# Altium schematic sheet Pg3-Voltage signal condtioning.SchDoc: Analog Front End Opamp (Voltage)
size 431 x 279 mm; Date: Not shown in title block; ApprovedBy: Not shown in title block; CheckedBy: Not shown in title block; Author: Not shown in title block; CompanyName: Not shown in title block; Engineer: Not shown in title block; Organization: Not shown in title block; Address1: Not shown in title block; Address2: Not shown in title block; Address3: Not shown in title block; Address4: Not shown in title block; DocumentNumber: 4; Revision: Use project parameter SCH_Rev; SheetNumber: 3; SheetTotal: 7; PageSetup: Record=PageOptions|CenterHorizontal=True|CenterVertical=True|PrintScale=1.00|XCorrection=1.00|YCorrection=1.00|PrintKind=0|BorderSize=5000000|LeftOffset=0|BottomOffset=0|Orientation=2|PaperLength=1000|PaperWidth=1000|Scale=100|PaperSource=15|PrintQuality=600|MediaType=1|DitherType=10|PaperKind=Letter|PrintScaleMode=1; CurrentTime: Not shown in title block; CurrentDate: Not shown in title block; Time: Not shown in title block; DocumentFullPathAndName: Not shown in title block; DocumentName: Not shown in title block; ModifiedDate: Not shown in title block; ImagePath: Not shown in title block
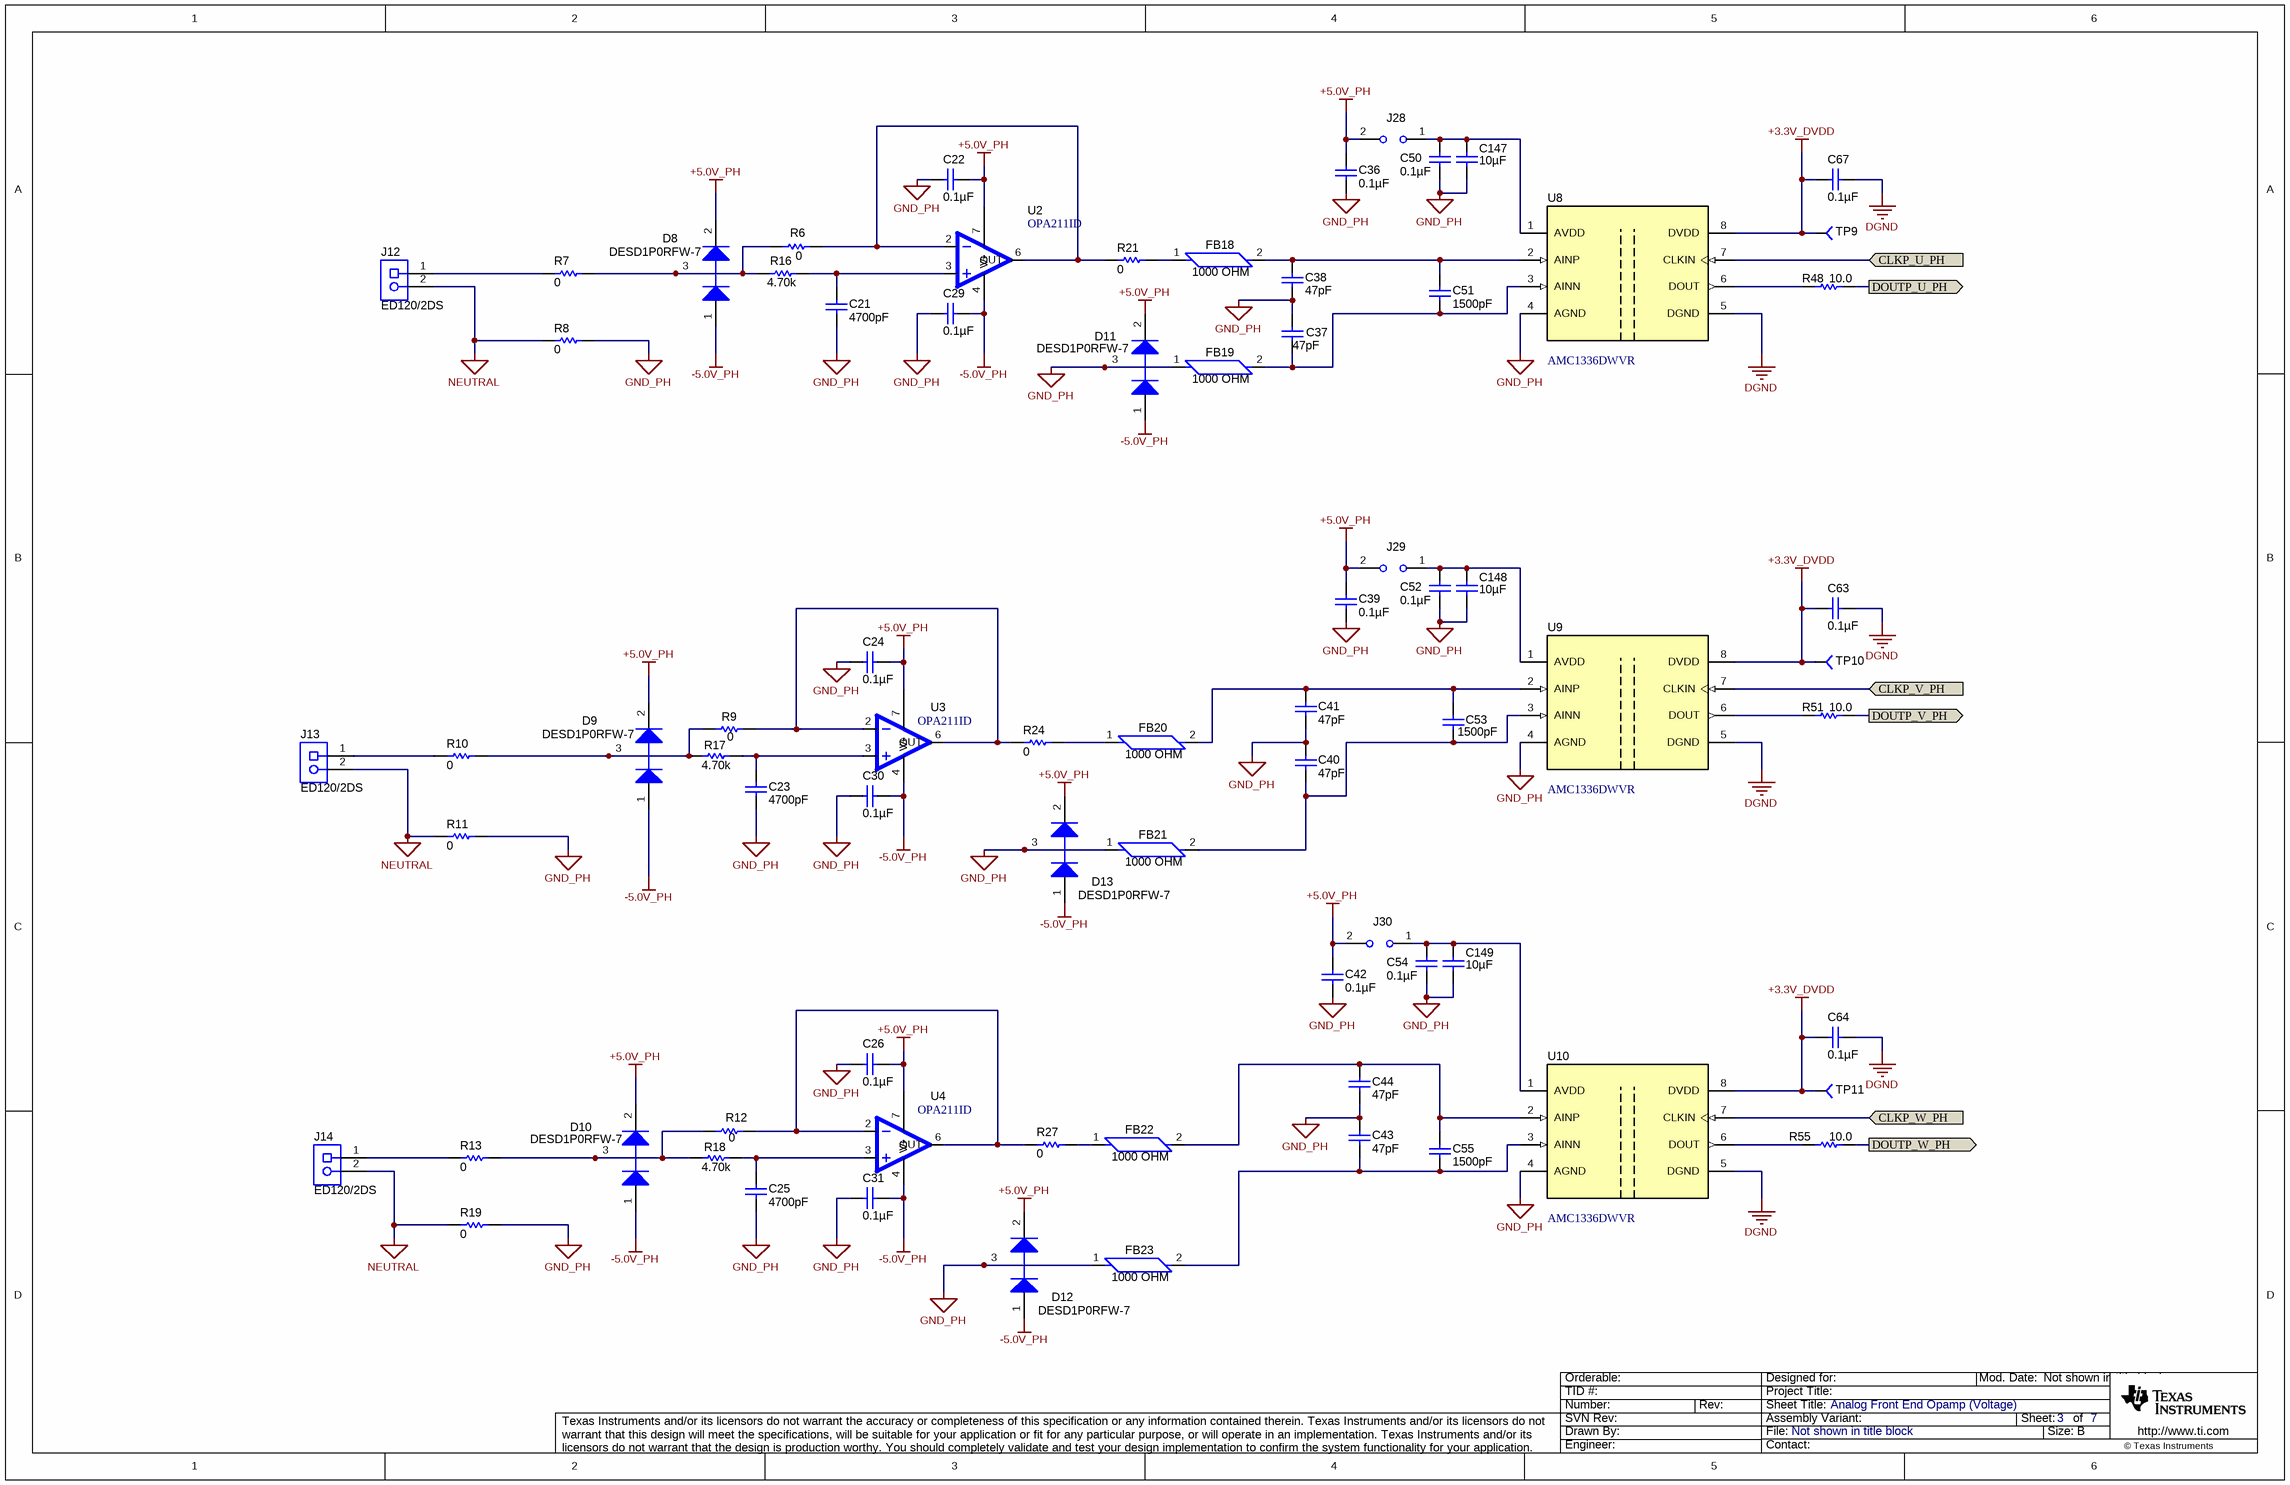
[diagram p0: Pg3-Voltage signal condtioning.SchDoc]

## Parts
C21  ValueDisplayed: 4700pF  [0603]
C22  ValueDisplayed: 0.1µF  [0603]
C23  ValueDisplayed: 4700pF  [0603]
C24  ValueDisplayed: 0.1µF  [0603]
C25  ValueDisplayed: 4700pF  [0603]
C26  ValueDisplayed: 0.1µF  [0603]
C29  ValueDisplayed: 0.1µF  [0603]
C30  ValueDisplayed: 0.1µF  [0603]
C31  ValueDisplayed: 0.1µF  [0603]
C36  ValueDisplayed: 0.1µF  [0603]
C37  ValueDisplayed: 47pF  [0805_HV]  (hidden comment: GRM21A5C2E470JW01D)
C38  ValueDisplayed: 47pF  [0805_HV]  (hidden comment: GRM21A5C2E470JW01D)
C39  ValueDisplayed: 0.1µF  [0603]
C40  ValueDisplayed: 47pF  [0805_HV]  (hidden comment: GRM21A5C2E470JW01D)
C41  ValueDisplayed: 47pF  [0805_HV]  (hidden comment: GRM21A5C2E470JW01D)
C42  ValueDisplayed: 0.1µF  [0603]
C43  ValueDisplayed: 47pF  [0805_HV]  (hidden comment: GRM21A5C2E470JW01D)
C44  ValueDisplayed: 47pF  [0805_HV]  (hidden comment: GRM21A5C2E470JW01D)
C50  ValueDisplayed: 0.1µF  [0603]
C51  ValueDisplayed: 1500pF  [0603]  (hidden comment: 06031C152KAT2A)
C52  ValueDisplayed: 0.1µF  [0603]
C53  ValueDisplayed: 1500pF  [0603]  (hidden comment: 06031C152KAT2A)
C54  ValueDisplayed: 0.1µF  [0603]
C55  ValueDisplayed: 1500pF  [0603]  (hidden comment: 06031C152KAT2A)
C63  ValueDisplayed: 0.1µF  [0603]
C64  ValueDisplayed: 0.1µF  [0603]
C67  ValueDisplayed: 0.1µF  [0603]
C147  ValueDisplayed: 10µF  [1210]
C148  ValueDisplayed: 10µF  [1210]
C149  ValueDisplayed: 10µF  [1210]
D8  DESD1P0RFW-7  [SOT-323]
D9  DESD1P0RFW-7  [SOT-323]
D10  DESD1P0RFW-7  [SOT-323]
D11  value DESD1P0RFW-7  [SOT-323]
D12  value DESD1P0RFW-7  [SOT-323]
D13  value DESD1P0RFW-7  [SOT-323]
FB18  value 1000 OHM  [FB0603]  (hidden comment: MMZ1608B102C)
FB19  value 1000 OHM  [FB0603]  (hidden comment: MMZ1608B102C)
FB20  value 1000 OHM  [FB0603]  (hidden comment: MMZ1608B102C)
FB21  value 1000 OHM  [FB0603]  (hidden comment: MMZ1608B102C)
FB22  value 1000 OHM  [FB0603]  (hidden comment: MMZ1608B102C)
FB23  value 1000 OHM  [FB0603]  (hidden comment: MMZ1608B102C)
J12  ED120/2DS  [CONN_ED120-2DS]
J13  ED120/2DS  [CONN_ED120-2DS]
J14  ED120/2DS  [CONN_ED120-2DS]
J28  (no value)  [HDR100_1X2]
J29  (no value)  [HDR100_1X2]
J30  (no value)  [HDR100_1X2]
R6  value 0  [0603]  (hidden comment: CRCW06030000Z0EA)
R7  value 0  [0805_HV]  (hidden comment: CRCW08050000Z0EA)
R8  value 0  [0805_HV]  (hidden comment: CRCW08050000Z0EA)
R9  value 0  [0603]  (hidden comment: CRCW06030000Z0EA)
R10  value 0  [0805_HV]  (hidden comment: CRCW08050000Z0EA)
R11  value 0  [0805_HV]  (hidden comment: CRCW08050000Z0EA)
R12  value 0  [0603]  (hidden comment: CRCW06030000Z0EA)
R13  value 0  [0805_HV]  (hidden comment: CRCW08050000Z0EA)
R16  value 4.70k  [0603]
R17  value 4.70k  [0603]
R18  value 4.70k  [0603]
R19  value 0  [0805_HV]  (hidden comment: CRCW08050000Z0EA)
R21  value 0  [0603]
R24  value 0  [0603]
R27  value 0  [0603]
R48  value 10.0  [0603]
R51  value 10.0  [0603]
R55  value 10.0  [0603]
TP9  (no value)  [TP-040_RND]
TP10  (no value)  [TP-040_RND]
TP11  (no value)  [TP-040_RND]
U2  OPA211ID  [SO8]
U3  OPA211ID  [SO8]
U4  OPA211ID  [SO8]
U8  AMC1336DWVR  [DWV0008A]
U9  AMC1336DWVR  [DWV0008A]
U10  AMC1336DWVR  [DWV0008A]

## Ports
CLKP_U_PH (in), CLKP_V_PH (in), CLKP_W_PH (in), DOUTP_U_PH (out), DOUTP_V_PH (out), DOUTP_W_PH (out)

## Nets
+3.3V_DVDD: C63.2 C64.2 C67.2 TP9.1 TP10.1 TP11.1 U8.8(DVDD) U9.8(DVDD) U10.8(DVDD)
+5.0V_PH: C22.2 C24.2 C26.2 C36.1 C39.1 C42.1 D8.2(K) D9.2(K) D10.2(K) D11.2(K) D12.2(K) D13.2(K) J28.2 J29.2 J30.2 U2.7(V+) U3.7(V+) U4.7(V+)
-5.0V_PH: C29.2 C30.2 C31.2 D8.1(A) D9.1(A) D10.1(A) D11.1(A) D12.1(A) D13.1(A) U2.4(V-) U3.4(V-) U4.4(V-)
DGND: C63.1 C64.1 C67.1 U8.5(DGND) U9.5(DGND) U10.5(DGND)
GND_PH: C21.2 C22.1 C23.2 C24.1 C25.2 C26.1 C29.1 C30.1 C31.1 C36.2 C37.1 C38.1 C39.2 C40.1 C41.1 C42.2 C43.1 C44.1 C50.2 C52.2 C54.2 C147.1 C148.1 C149.1 D11.3(C) D12.3(C) D13.3(C) FB19.1 FB21.1 FB23.1 R8.2 R11.2 R19.2 U8.4(AGND) U9.4(AGND) U10.4(AGND)
NEUTRAL: J12.2 J13.2 J14.2 R8.1 R11.1 R19.1
CLKP_U_PH: U8.7(CLKIN) ; port CLKP_U_PH
CLKP_V_PH: U9.7(CLKIN) ; port CLKP_V_PH
CLKP_W_PH: U10.7(CLKIN) ; port CLKP_W_PH
DOUTP_U_PH: R48.2 ; port DOUTP_U_PH
DOUTP_V_PH: R51.2 ; port DOUTP_V_PH
DOUTP_W_PH: R55.2 ; port DOUTP_W_PH
NetC21_1: C21.1 R16.2 U2.3
NetC23_1: C23.1 R17.2 U3.3
NetC25_1: C25.1 R18.2 U4.3
NetC37_2: C37.2 C51.2 FB19.2 U8.3(AINN)
NetC38_2: C38.2 C51.1 FB18.2 U8.2(AINP)
NetC40_2: C40.2 C53.2 FB21.2 U9.3(AINN)
NetC41_2: C41.2 C53.1 FB20.2 U9.2(AINP)
NetC43_2: C43.2 C55.2 FB23.2 U10.3(AINN)
NetC44_2: C44.2 C55.1 FB22.2 U10.2(AINP)
NetC50_1: C50.1 C147.2 J28.1 U8.1(AVDD)
NetC52_1: C52.1 C148.2 J29.1 U9.1(AVDD)
NetC54_1: C54.1 C149.2 J30.1 U10.1(AVDD)
NetD8_3: D8.3(C) R6.1 R7.2 R16.1
NetD9_3: D9.3(C) R9.1 R10.2 R17.1
NetD10_3: D10.3(C) R12.1 R13.2 R18.1
NetFB18_1: FB18.1 R21.2
NetFB20_1: FB20.1 R24.2
NetFB22_1: FB22.1 R27.2
NetJ12_1: J12.1 R7.1
NetJ13_1: J13.1 R10.1
NetJ14_1: J14.1 R13.1
NetR6_2: R6.2 R21.1 U2.2 U2.6(OUT)
NetR9_2: R9.2 R24.1 U3.2 U3.6(OUT)
NetR12_2: R12.2 R27.1 U4.2 U4.6(OUT)
NetR48_1: R48.1 U8.6(DOUT)
NetR51_1: R51.1 U9.6(DOUT)
NetR55_1: R55.1 U10.6(DOUT)

## Notes on the sheet
- Drawn By:
- SVN Rev:
- Number:
- TID #:
- Orderable:
- Rev:
- Sheet Title:
- File:
- Project Title:
- Designed for:
- Assembly Variant:
- Mod. Date:
- Sheet:
- Size:
- of
- B
- http://www.ti.com
- Texas Instruments and/or its licensors do not warrant the accuracy or completeness of this specification or any information contained therein. Texas Instruments and/or its licensors do not warrant that this design will meet the specifications, will be suitable for your application or fit for any particular purpose, or will operate in an implementation. Texas Instruments and/or its licensors do not warrant that the design is production worthy. You should completely validate and test your design implementation to confirm the system functionality for your application.
- Engineer:
- Contact:
- © Texas Instruments

## Library data of the parts
C21 C23 C25 = 06031C472KAT2A: CAP, CERM, 4700pF, 100V, +/-10%, X7R, 0603; Manufacturer: AVX; Polarized: N; CompType: Capacitor; U/M: EA; Cap_F: 0.0000000047; Tolerance_%: 10; ESR_Ohm: 0.136; Value1: 0.136 ohm; VDC_V: 100; TaMin_C: -55; TaMax_C: 125; SymbolVersion: 2008-07-09; Value: 4700pF; PartNumber: 06031C472KAT2A; PackageReference: 0603; RoHS: Y; Value2: 100V; MountType: SMT; Technology: Ceramic; TempCo: X7R; Cap_Case: 0603; Published: 2008-06-19; Publisher: Texas Instruments; LatestRevisionDate: 2013-12-06; ComponentLink1Description: Datasheet link; ComponentLink1URL: http://www.avx.com/docs/masterpubs/smccp.pdf; Supplier 1: Digi-Key; Supplier Part Number 1: 478-1203-1-ND; Supplier 2: Mouser; Supplier Part Number 2: 581-06031C472K; Supplier 3: Farnell; Supplier Part Number 3: 1833875
C22 C24 C26 C29-C31 C36 C39 C42 C50 C52 C54 = C0603C104K5RACTU: CAP, CERM, 0.1uF, 50V, +/-10%, X7R, 0603; Manufacturer: Kemet; Polarized: N; CompType: Capacitor; U/M: EA; Cap_F: 0.0000001; Tolerance_%: 10; Value1: Unknown; VDC_V: 50; TaMin_C: -55; TaMax_C: 125; SymbolVersion: 2008-07-09; Value: 0.1uF; PartNumber: C0603C104K5RACTU; PackageReference: 0603; RoHS: Y; Value2: 50V; MountType: SMT; Technology: Ceramic; TempCo: X7R; Cap_Case: 0603; Published: 2008-06-19; Publisher: Texas Instruments; LatestRevisionDate: 2013-12-06; ComponentLink1Description: Datasheet link; ComponentLink1URL: http://www.kemet.com/kemet/web/homepage/kechome.nsf/vapubfiles/F3102_Y5V.pdf/$file/F3102_Y5V.pdf; Supplier 1: Digi-Key; Supplier Part Number 1: 399-5089-1-ND; Supplier 2: Mouser; Supplier Part Number 2: 80-C0603C104K5R; Supplier 3: Farnell; Supplier Part Number 3: 1288255
C37 C38 C40 C41 C43 C44 = GRM21A5C2E470JW01D: CAP, CERM, 47pF, 500V, +/-5%, C0G/NP0, 0805; Manufacturer: MuRata; Polarized: N; CompType: Capacitor; U/M: EA; Cap_F: 0.000000000047; Tolerance_%: 5; Value1: Unknown; VDC_V: 250; Value2: 250V; TaMin_C: -55; TaMax_C: 125; Cap_Case: 0805; SymbolVersion: 2008-07-09; Value: 47pF; PartNumber: GRM21A5C2E470JW01D; PackageReference: 0805; RoHS: Y; MountType: SMT; Technology: Ceramic; TempCo: C0G/NP0; Published: 2008-06-19; Publisher: Texas Instruments; LatestRevisionDate: 2014-05-15; ComponentLink1Description: Datasheet link; ComponentLink1URL: http://search.murata.co.jp/Ceramy/PnsearchViewAction.do?HnOFG=ON&HnNFG=ON&SEL_CNT=50&sLang=en&sKey=GRM21A5C2E470JW01D&x=9&y=9&search=startwith; Supplier 1: Digi-Key; Supplier Part Number 1: 490-5538-1-ND; Supplier 2: Mouser; Supplier Part Number 2: 81-GRM21A5C2E470JW1D
C51 C53 C55 = 06031C152KAT2A: CAP, CERM, 1500pF, 100V, +/-10%, X7R, 0603; Manufacturer: AVX; Polarized: N; CompType: Capacitor; U/M: EA; Cap_F: 0.0000000015; Tolerance_%: 10; ESR_Ohm: 0.229; Value1: 0.229 ohm; VDC_V: 100; TaMin_C: -55; TaMax_C: 125; SymbolVersion: 2008-07-09; Value: 1500pF; PartNumber: 06031C152KAT2A; PackageReference: 0603; RoHS: Y; Value2: 100V; MountType: SMT; Technology: Ceramic; TempCo: X7R; Cap_Case: 0603; Published: 2008-06-19; Publisher: Texas Instruments; LatestRevisionDate: 2013-12-23; ComponentLink1Description: Datasheet link; ComponentLink1URL: http://www.avx.com/docs/masterpubs/smccp.pdf; Supplier 1: Digi-Key; Supplier Part Number 1: 478-1200-1-ND; Supplier 2: Mouser; Supplier Part Number 2: 581-06031C152K; Supplier 3: Farnell; Supplier Part Number 3: 1396445
C63 C64 C67 = 06033C104JAT2A: CAP, CERM, 0.1uF, 25V, +/-5%, X7R, 0603; Manufacturer: AVX; Polarized: N; CompType: Capacitor; U/M: EA; Cap_F: 0.0000001; Tolerance_%: 5; ESR_Ohm: 0.05; Value1: 0.05 ohm; VDC_V: 25; TaMin_C: -55; TaMax_C: 125; SymbolVersion: 2008-07-09; Value: 0.1uF; PartNumber: 06033C104JAT2A; PackageReference: 0603; RoHS: Y; Value2: 25V; MountType: SMT; Technology: Ceramic; TempCo: X7R; Cap_Case: 0603; Published: 2008-06-19; Publisher: Texas Instruments; LatestRevisionDate: 2013-12-06; ComponentLink1Description: Datasheet link; ComponentLink1URL: http://www.avx.com/docs/masterpubs/smccp.pdf; Supplier 1: Digi-Key; Supplier Part Number 1: 478-3713-1-ND; Supplier 2: Mouser; Supplier Part Number 2: 581-06033C104JAT2A; Supplier 3: Farnell; Supplier Part Number 3: 1740614
C147-C149 = GMK325AB7106MM-T: CAP, CERM, 10uF, 35V, +/-20%, X7R, 1210; Manufacturer: Taiyo Yuden; Polarized: N; CompType: Capacitor; U/M: EA; Cap_F: 0.00001; Tolerance_%: 20; Value1: Unknown; VDC_V: 35; TaMin_C: -55; TaMax_C: 125; PackageReference: 1210; PartNumber: GMK325AB7106MM-T; SymbolVersion: 2008-07-09; Value: 10uF; RoHS: Y; Value2: 35V; MountType: SMT; Technology: Ceramic; Cap_Case: 1210; Publisher: Texas Instruments; LatestRevisionDate: 2013-12-06; ComponentLink1Description: Datasheet link; ComponentLink1URL: http://www.yuden.co.jp/productdata/catalog/en/mlcc01_e.pdf; Supplier 1: Digi-Key; Supplier Part Number 1: 587-2779-1-ND; Supplier 2: Mouser; Supplier Part Number 2: 963-GMK325AB7106MM-T; Supplier 3: Farnell; Supplier Part Number 3: 1894510; TempCo: X7R; Published: 2008-06-19
D8-D10 = BAV99WT1G: Diode, P-N, 70V, 0.2A, SOT-323; Manufacturer: Diodes Inc; Value: DNP; SymbolVersion: 2011-08-17; PartNumber: DESD1P0RFW-7; PackageReference: SOT-323; CompType: Diode; MountType: SMT; Type: P-N; RoHS: Y; Published: 2008-06-26; Publisher: Texas Instruments; LatestRevisionDate: 2013-11-22; ComponentLink1Description: Datasheet link; ComponentLink1URL: http://www.diodes.com/datasheets/DESD1P0RFW.pdf; Supplier 1: Digi-Key; Supplier Part Number 1: DESD1P0RFW-7DIDKR-ND; Supplier 2: Mouser; Supplier Part Number 2: 512-BAV99WT1G
D11-D13 = BAV99WT1G: Diode, P-N, 70V, 0.2A, SOT-323; Manufacturer: Diodes Inc; SymbolVersion: 2011-08-17; PartNumber: DESD1P0RFW-7; PackageReference: SOT-323; CompType: Diode; MountType: SMT; Type: P-N; RoHS: Y; Published: 2008-06-26; Publisher: Texas Instruments; LatestRevisionDate: 2013-11-22; ComponentLink1Description: Datasheet link; ComponentLink1URL: http://www.diodes.com/datasheets/DESD1P0RFW.pdf; Supplier 1: Digi-Key; Supplier Part Number 1: DESD1P0RFW-7DIDKR-ND; Supplier 2: Mouser; Supplier Part Number 2: 512-BAV99WT1G
FB18-FB23 = MMZ1608B102C: FERRITE CHIP 1000 OHM 300MA 0603; Manufacturer: TDK Corporation; CompType: Ferrite Bead; PartNumber: MMZ1608B102C; MountType: SMT; Alternate PartNumber: *; Supplier 1: Digi-Key; ComponentLink1URL: http://www.tdk.co.jp/tefe02/e9412_mmz.pdf; ComponentLink1Description: Datasheet link; Publisher: TI; Supplier Part Number 1: 445-8672-1-ND; PackageReference: 0603; Alternate Manufacturer: *; RoHS: Y
J12-J14 = ED120/2DS: TERMINAL BLOCK 5.08MM VERT 2POS, TH; Manufacturer: On-Shore Technology; SymbolCreator: a0412235; U/M: EA; SymbolVersion: 2013-09-04; PartNumber: ED120/2DS; PackageReference: TERM_BLK, 2pos, 5.08mm; CompType: Terminal Block; RoHS: Y; MountType: TH; ComponentLink1Description: Datasheet Link; ComponentLink1URL: http://www.on-shore.com/sites/default/files/manuals/ed120ds.pdf; Publisher: Texas Instruments; LatestRevisionDate: 2013-12-06; Supplier 1: Digi-Key; Supplier Part Number 1: ED1609-ND
J28-J30 = JUMPER_2X100MIL: Header, Male 2-pin, 100mil spacing,; Manufacturer: FCI; PartNumber: 68001-402HLF; area: 20000; Value: 68001-402HLF; ComponentLink1URL: \\vette02\pmp_pcb\pcad_pdf's\pec36saan.pdf; ComponentHeight: 0.330 inch; SymbolVersion: 09/30/2009 09:55:05; PackageReference: 0.100 inch x 2; ComponentLink1Description: AEO Datasheet Link; Supplier 1: Digi-Key; Supplier Part Number 1: 609-3507-ND
R6 R9 R12 R21 R24 R27 = CRCW06030000Z0EA: RES, 0 ohm, 5%, 0.1W, 0603; Manufacturer: Vishay-Dale; CompType: Resistor; Value_Code: 0000; Tolerance_%: 5; Power_W: 0.1; VDC_V: 75; TempCo: 200 ppm/C; EIA_Code: E24; U/M: EA; SymbolVersion: 2009-05-29; PartNumber: CRCW06030000Z0EA; PackageReference: 0603; RoHS: Y; Res_ohm: 0; Value1: 5%; Value2: 0.1W; MountType: SMT; Technology: Thick Film; Published: 2008-06-26; Publisher: Texas Instruments; LatestRevisionDate: 2013-10-22; ComponentLink1Description: Datasheet link; ComponentLink1URL: http://www.vishay.com/docs/20035/dcrcwe3.pdf; Supplier 1: Digi-Key; Supplier Part Number 1: 541-0.0GCT-ND; Supplier 2: Mouser; Supplier Part Number 2: 71-CRCW0603-0-E3; Supplier 3: Farnell; Supplier Part Number 3: 1469739
R7 R8 R10 R11 R13 R19 = CRCW08050000Z0EA: RES, 0 ohm, 5%, 0.125W, 0805; Manufacturer: Vishay-Dale; CompType: Resistor; Value_Code: 0000; Tolerance_%: 5; Power_W: 0.125; VDC_V: 150; TempCo: 200 ppm/C; EIA_Code: E24; U/M: EA; SymbolVersion: 2009-05-29; PartNumber: CRCW08050000Z0EA; PackageReference: 0805; RoHS: Y; Res_ohm: 0; Value1: 5%; Value2: 0.125W; MountType: SMT; Technology: Thick Film; Published: 2008-06-26; Publisher: Texas Instruments; LatestRevisionDate: 2014-04-18; ComponentLink1Description: Datasheet link; ComponentLink1URL: http://www.vishay.com/docs/20035/dcrcwe3.pdf; Supplier 1: Digi-Key; Supplier Part Number 1: 541-0.0ACT-ND; Supplier 2: Mouser; Supplier Part Number 2: 71-CRCW0805-0-E3; Supplier 3: Farnell; Supplier Part Number 3: 1469846
R16-R18 = RC0603FR-074K7L: RES, 4.70k ohm, 1%, 0.1W, 0603; Manufacturer: Yageo America; CompType: Resistor; Res_ohm: 4700; Value_Code: 4k70; Tolerance_%: 1; Power_W: 0.1; VDC_V: 150; TempCo: 200 ppm/C; U/M: EA; SymbolVersion: 2009-05-29; PartNumber: RC0603FR-074K7L; PackageReference: 0603; RoHS: Y; Value1: 1%; Value2: 0.1W; MountType: SMT; Technology: Thick Film; Published: 2008-06-26; Publisher: Texas Instruments; LatestRevisionDate: 2013-10-22; ComponentLink1Description: Datasheet link; ComponentLink1URL: http://www.yageo.com/pdf/Pu-RC0603_51_PbFree_L_2.pdf; Supplier 1: Digi-Key; Supplier Part Number 1: 311-4.70KHRCT-ND; Supplier 2: Mouser; Supplier Part Number 2: 603-RC0603FR-074K7L; Supplier 3: Farnell; Supplier Part Number 3: 9238565
R48 R51 R55 = CRCW060310R0FKEA: RES, 10.0 ohm, 1%, 0.1W, 0603; Manufacturer: Vishay-Dale; CompType: Resistor; Res_ohm: 10; Value_Code: 10R0; Tolerance_%: 1; Power_W: 0.1; VDC_V: 75; TempCo: 100 ppm/C; EIA_Code: E96; U/M: EA; SymbolVersion: 2009-05-29; PartNumber: CRCW060310R0FKEA; PackageReference: 0603; RoHS: Y; Value1: 1%; Value2: 0.1W; MountType: SMT; Technology: Thick Film; Published: 2008-06-26; Publisher: Texas Instruments; LatestRevisionDate: 2013-10-22; ComponentLink1Description: Datasheet link; ComponentLink1URL: http://www.vishay.com/docs/20035/dcrcwe3.pdf; Supplier 1: Digi-Key; Supplier Part Number 1: 541-10.0HCT-ND; Supplier 2: Mouser; Supplier Part Number 2: 71-CRCW0603-10-E3; Supplier 3: Farnell; Supplier Part Number 3: 1469751
TP9-TP11 = TP-040_RND: Test Point, O.040 Hole; Manufacturer: STD; Value: STD; area: *; SymbolVersion: 06/30/2008 16:03:57; PartNumber: STD; ComponentLink1Description: AEO Datasheet Link
U2-U4 = OPA211AID: IC, 1.1nV/vHz Noise, Low Power, Precision OpAmp; Manufacturer: Texas Instruments; Alternate Manufacturer: None; Area: 75900; ComponentLink1URL: \\vette02\pmp_pcb\pcad_pdf's\opa211.pdf; SymbolVersion: 04/09/2010 12:57:45; PackageReference: SO; ComponentHeight: 0.069 inch; PartNumber: OPA211ID; Value: OPA211ID; ComponentLink1Description: AEO Datasheet Link
U8-U10 = CMP-0860008-1: AMC1336 Small, High-Precision, Reinforced Isolated Delta-Sigma Modulator With Input Optimized for Voltage Sensing Applications, DWV0008A (SOIC-8); Manufacturer: Texas Instruments; AEC Qualified: N; AEC Category: Q200; SizeY_mm: 5.85; SizeX_mm: 11.5; SizeAreaWB_mm2: 105.975; SizeArea_mm2: 67.275; CompType: IC; SizeZ_mm: 2.8; ComponentLink3URL: http://www.ti.com/product/amc1336/datasheet; PackageDescription: SOIC-8; MountType: SMT; Alternate PartNumber: AMC1336DWV; PartNumber: AMC1336DWVR; PackageReference: DWV0008A; ComponentLink3Description: Online Datasheet; Alternate Manufacturer: Texas Instruments; ComponentLink1URL: http://www.ti.com/lit/ds/symlink/amc1336.pdf; ComponentLink2Description: Product Folder; ComponentLink1Description: Datasheet Link; ComponentLink2URL: http://www.ti.com/product/amc1336